# EAGLE design board (EAGLE 6.5.0)
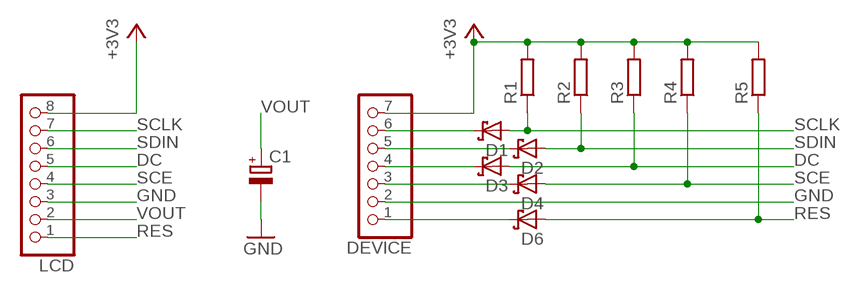
[diagram p0: schematic, sheet 1]

## Parts
C1  CPOL-EUE2.5-5  [E2,5-5]
D1  SCHOTTKY-DIODESMD  [SMB]
D2  SCHOTTKY-DIODESMD  [SMB]
D3  SCHOTTKY-DIODESMD  [SMB]
D4  SCHOTTKY-DIODESMD  [SMB]
D6  SCHOTTKY-DIODESMD  [SMB]
DEVICE  PINHD-1X7  [1X07]
LCD  PINHD-1X8  [1X08]
R1  R-EU_R0805  [R0805]
R2  R-EU_R0805  [R0805]
R3  R-EU_R0805  [R0805]
R4  R-EU_R0805  [R0805]
R5  R-EU_R0805  [R0805]

## Nets
+3V3: DEVICE.7 LCD.8 R1.2 R2.2 R3.2 R4.2 R5.2
DC: D3.A LCD.5 R3.1
GND: C1.- DEVICE.2 LCD.3
N$1: D1.C DEVICE.6
N$2: D2.C DEVICE.5
N$3: D3.C DEVICE.4
N$4: D4.C DEVICE.3
N$6: D6.C DEVICE.1
RES: D6.A LCD.1 R5.1
SCE: D4.A LCD.4 R4.1
SCLK: D1.A LCD.7 R1.1
SDIN: D2.A LCD.6 R2.1
VOUT: C1.+ LCD.2

## Library data of the parts
C1 = resistor:CPOL-EU: POLARIZED CAPACITOR, European symbol
D1-D4 D6 = diode:SCHOTTKY-DIODE: Schottky Diode
DEVICE = pinhead:PINHD-1X7: PIN HEADER
LCD = pinhead:PINHD-1X8: PIN HEADER
R1-R5 = resistor:R-EU_: RESISTOR, European symbol

## Board
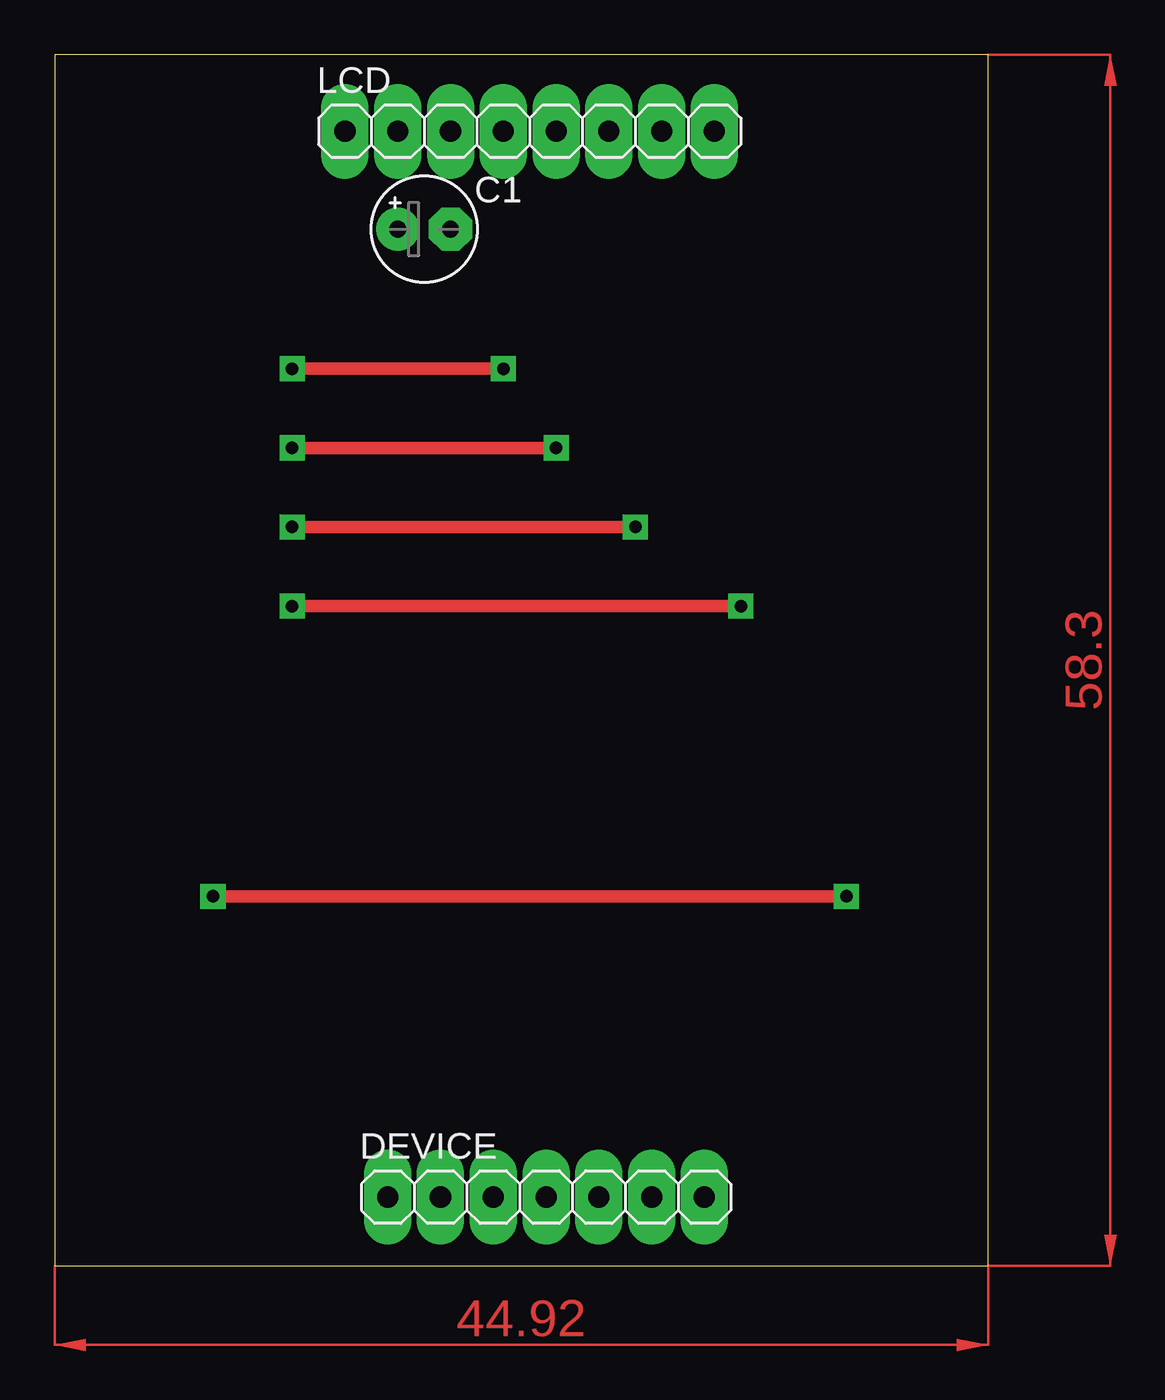
[diagram p1: board, top side]
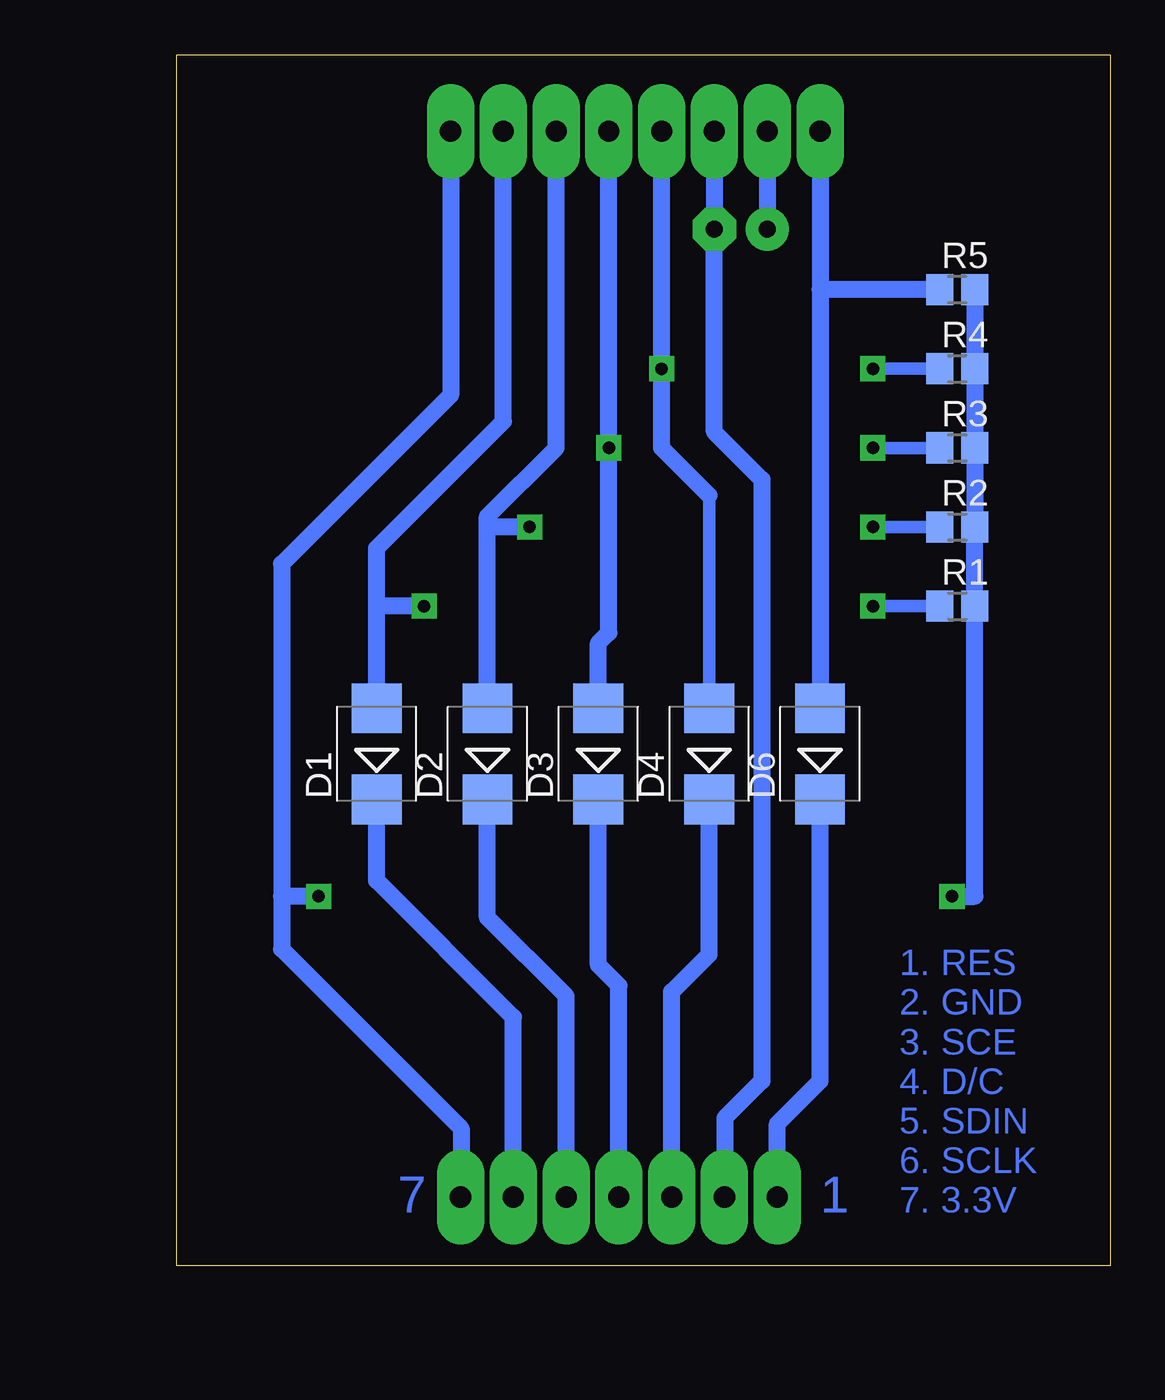
[diagram p2: board, bottom side, seen from below]

Size 44.92 x 58.3 mm. Coordinates in mm from the lower left corner, seen from the top.
Outline: 0,0 44.92,0 44.92,58.3 0,58.3 0,0
Copper layers (1*16): Top 0.035mm / dielectric 1.5mm / Bottom 0.035mm
Design rules "default": minimum track width 10mil, minimum drill 32mil, track to track 12mil, track to pad 12mil, pad to pad 12mil, via to via 12mil, smd to smd 8mil, copper to edge 40mil, drill to drill 40mil, minimum pad ring 25mil, minimum via ring 12mil, stop-mask expansion 4mil, vias tented up to drill 0mil, thermal gap 10mil
tKeepout: area 1.5,6.7 to 43.5,49.7

### Footprints (pad centres in the part's own frame; a part is rotated, then mirrored left to right if it is on the bottom)
E2,5-5 = drill 0.813 pad 1.6: + -1.27,0 | drill 0.813 pad 1.6 octagon: - 1.27,0
SMB = smd 2.4 x 2.4: A 2.2,0; C -2.2,0
1X07 = drill 1.016 long: 1 -7.62,0; 2 -5.08,0; 3 -2.54,0; 4 0,0; 5 2.54,0; 6 5.08,0; 7 7.62,0
1X08 = drill 1.016 long: 1 -8.89,0; 2 -6.35,0; 3 -3.81,0; 4 -1.27,0; 5 1.27,0; 6 3.81,0; 7 6.35,0; 8 8.89,0
R0805 = smd 1.3 x 1.5: 1 -0.85,0; 2 0.85,0

### Placement (x,y rotation side)
C1  17.78,49.89 0 top
D1  35.31,24.64 90 bottom
D2  29.97,24.64 90 bottom
D3  24.64,24.64 90 bottom
D4  19.3,24.64 90 bottom
D6  13.97,24.64 90 bottom
DEVICE  23.65,3.3 0 top
LCD  22.86,54.61 0 top
R1  7.37,31.75 0 bottom
R2  7.37,35.56 0 bottom
R3  7.37,39.37 0 bottom
R4  7.37,43.18 0 bottom
R5  7.37,46.99 0 bottom

### Tracks (layer width: path | path; a pad name or v marks a point on that pad's centre or on a via)
+3V3  (via drill 0.6)
  Top 0.61: v7.62,17.78 v38.1,17.78
  Bottom 0.61: 31.24,3.33 DEVICE.7
  Bottom 0.813: LCD.8 31.75,41.91 39.88,33.78 39.88,17.78 | 39.88,17.78 39.88,15.24 31.24,6.6 31.24,3.33 | R5.2 R4.2 R3.2 R2.2 R1.2 6.52,17.78 v7.62,17.78 | v38.1,17.78 39.88,17.78
DC  (via drill 0.6)
  Top 0.61: v11.43,39.37 v24.13,39.37
  Bottom 0.61: R3.1 v11.43,39.37
  Bottom 0.813: LCD.5 v24.13,39.37 24.13,30.48 24.64,29.97 D3.A
GND
  Bottom 0.61: 18.54,3.33 DEVICE.2
  Bottom 0.813: 18.54,3.33 18.54,7.11 16.76,8.89 16.76,37.85 19.05,40.13 C1.- LCD.3
N$1
  Bottom 0.813: DEVICE.6 28.73,11.96 35.31,18.54 D1.C
N$2
  Bottom 0.813: DEVICE.5 26.19,12.98 29.97,16.76 D2.C
N$3
  Bottom 0.813: DEVICE.4 23.65,13.49 24.64,14.48 D3.C
N$4
  Bottom 0.813: DEVICE.3 21.11,13.18 19.3,14.99 D4.C
N$6
  Bottom 0.813: DEVICE.1 16.03,6.83 13.97,8.89 D6.C
RES
  Bottom 0.813: LCD.1 13.97,46.99 | 13.97,46.99 D6.A | R5.1 13.97,46.99
SCE  (via drill 0.6)
  Top 0.61: v11.43,43.18 v21.59,43.18
  Bottom 0.61: D4.A 19.3,37.08 | R4.1 v11.43,43.18
  Bottom 0.813: 19.3,37.08 21.59,39.37 v21.59,43.18 LCD.4
SCLK  (via drill 0.6)
  Top 0.61: v11.43,31.75 v33.02,31.75
  Bottom 0.61: R1.1 v11.43,31.75
  Bottom 0.813: D1.A 35.31,31.75 | 35.31,31.75 35.31,34.54 29.21,40.64 LCD.7 | v33.02,31.75 35.31,31.75
SDIN  (via drill 0.6)
  Top 0.61: v11.43,35.56 v27.94,35.56
  Bottom 0.61: R2.1 v11.43,35.56
  Bottom 0.813: D2.A 29.97,35.56 | 29.97,35.56 29.97,36.07 26.67,39.37 LCD.6 | v27.94,35.56 29.97,35.56
VOUT
  Bottom 0.813: LCD.2 C1.+
(copper drawn outside any net)
  shapes: Top area x2

### Text on the board
Bottom: 1. RES / 2. GND / 3. SCE / 4. D/C / 5. SDIN / 6. SCLK / 7. 3.3V | 1 | 7